# Altium schematic sheet rxcalibrate.SchDoc
size 762 x 762 mm
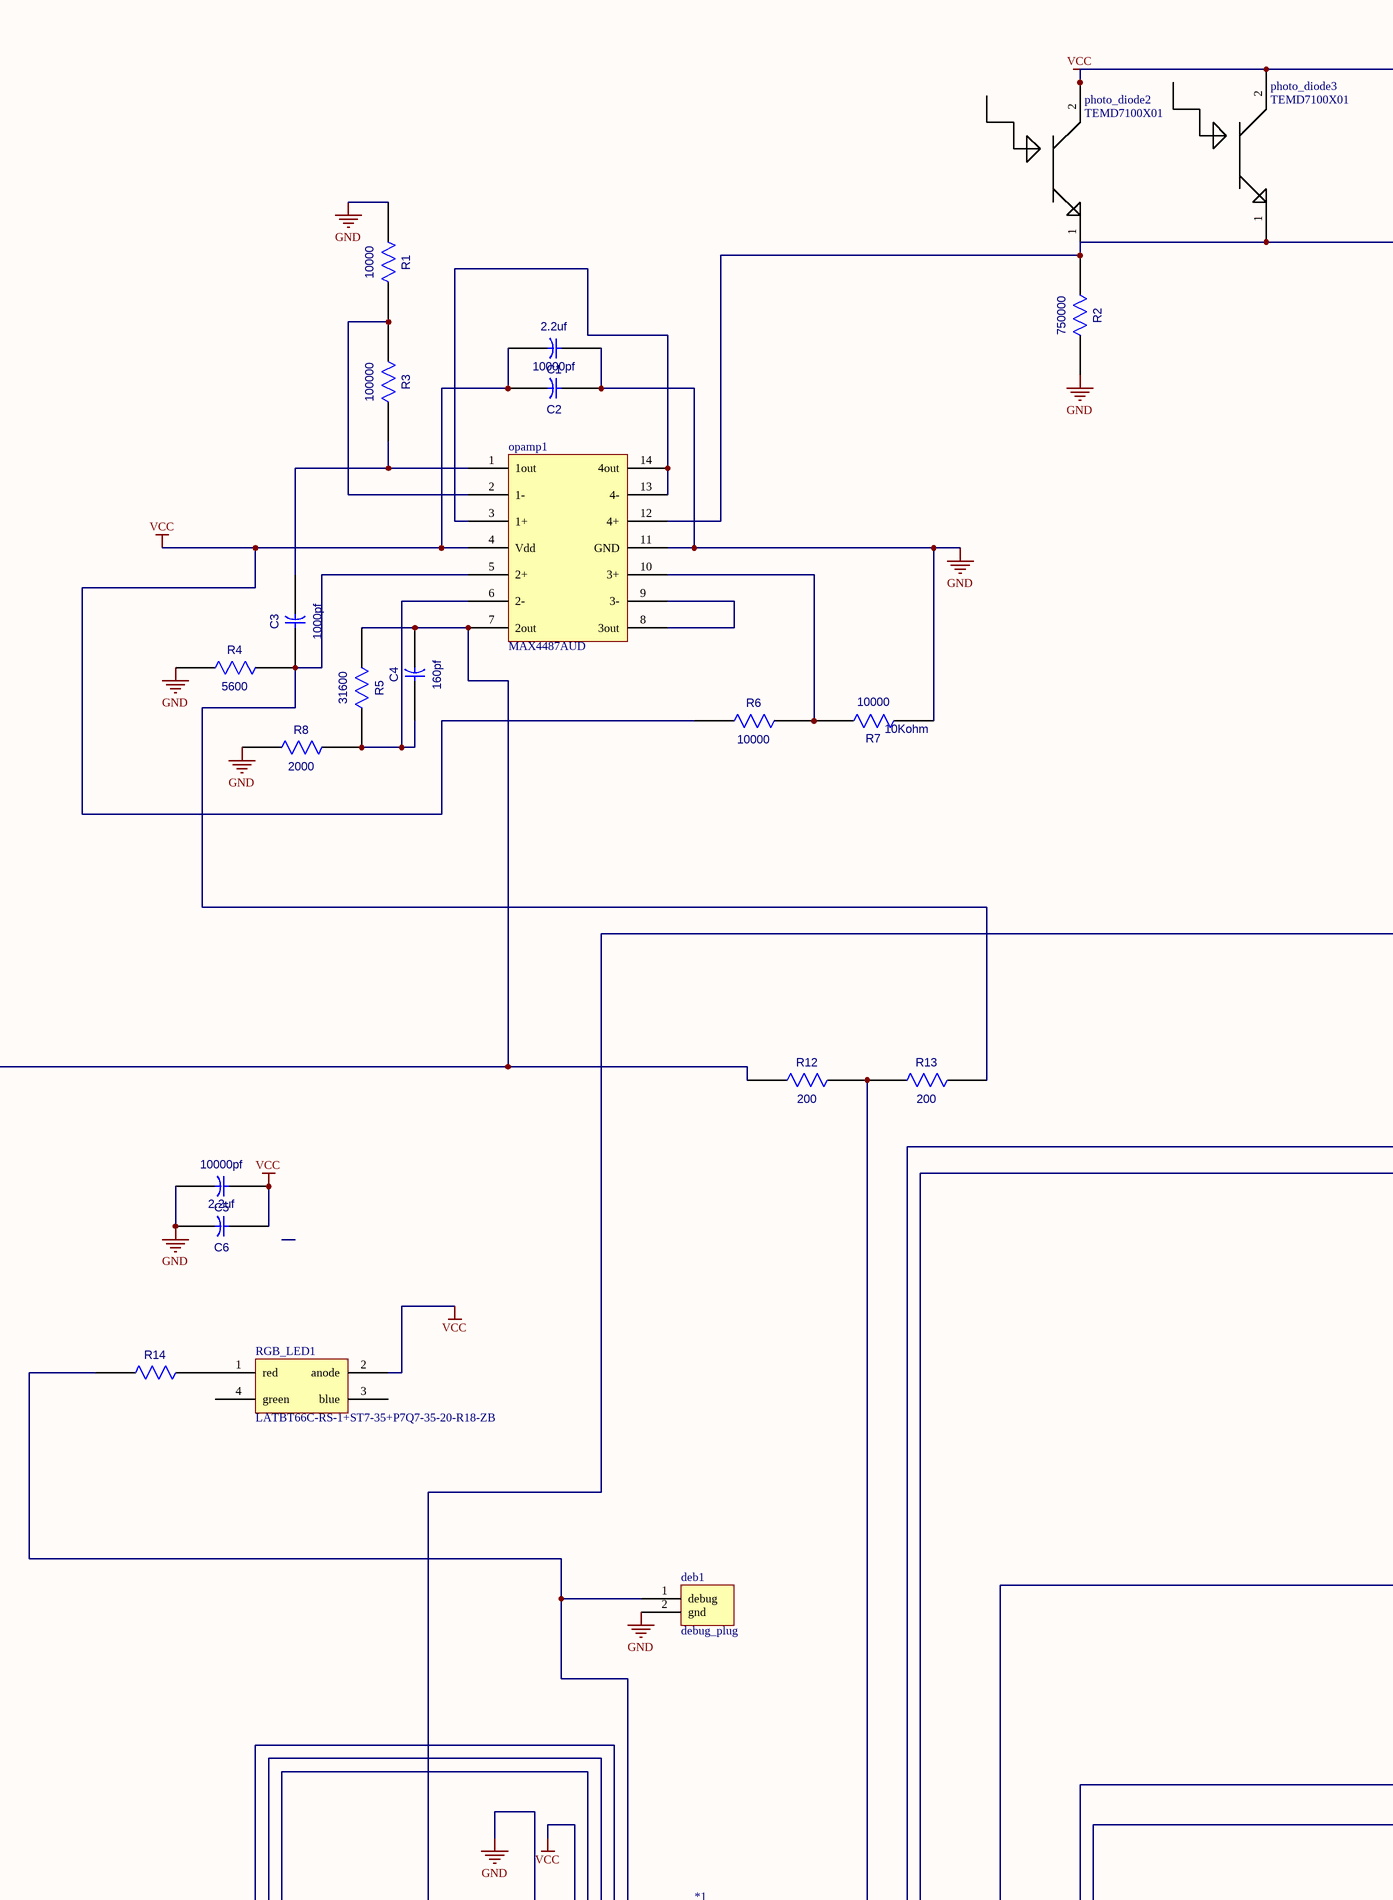
[diagram p0: rxcalibrate.SchDoc, top left]
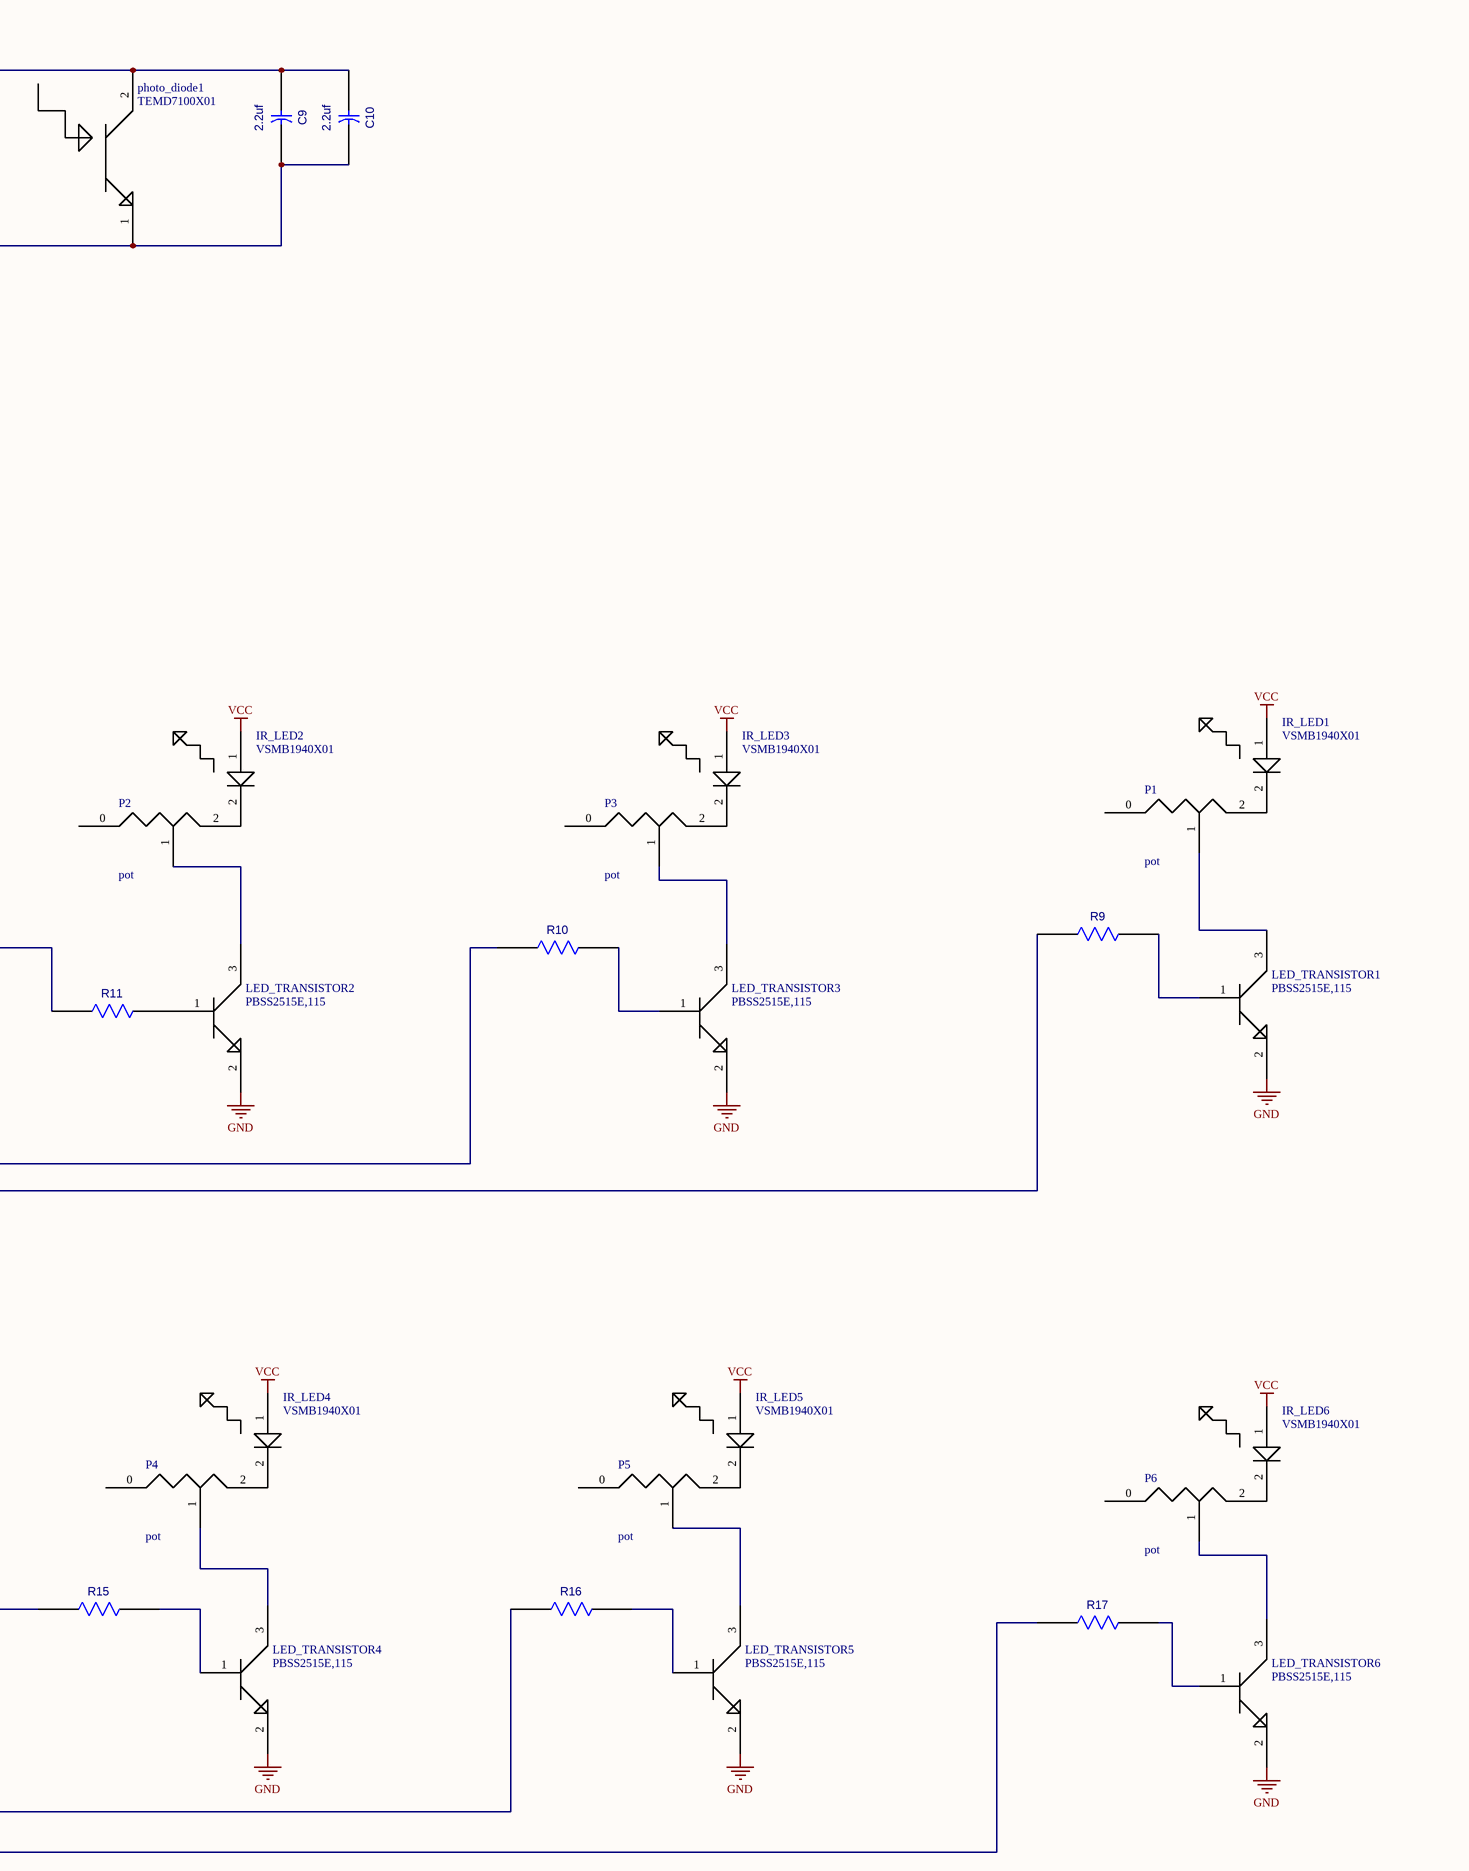
[diagram p1: rxcalibrate.SchDoc, top right]
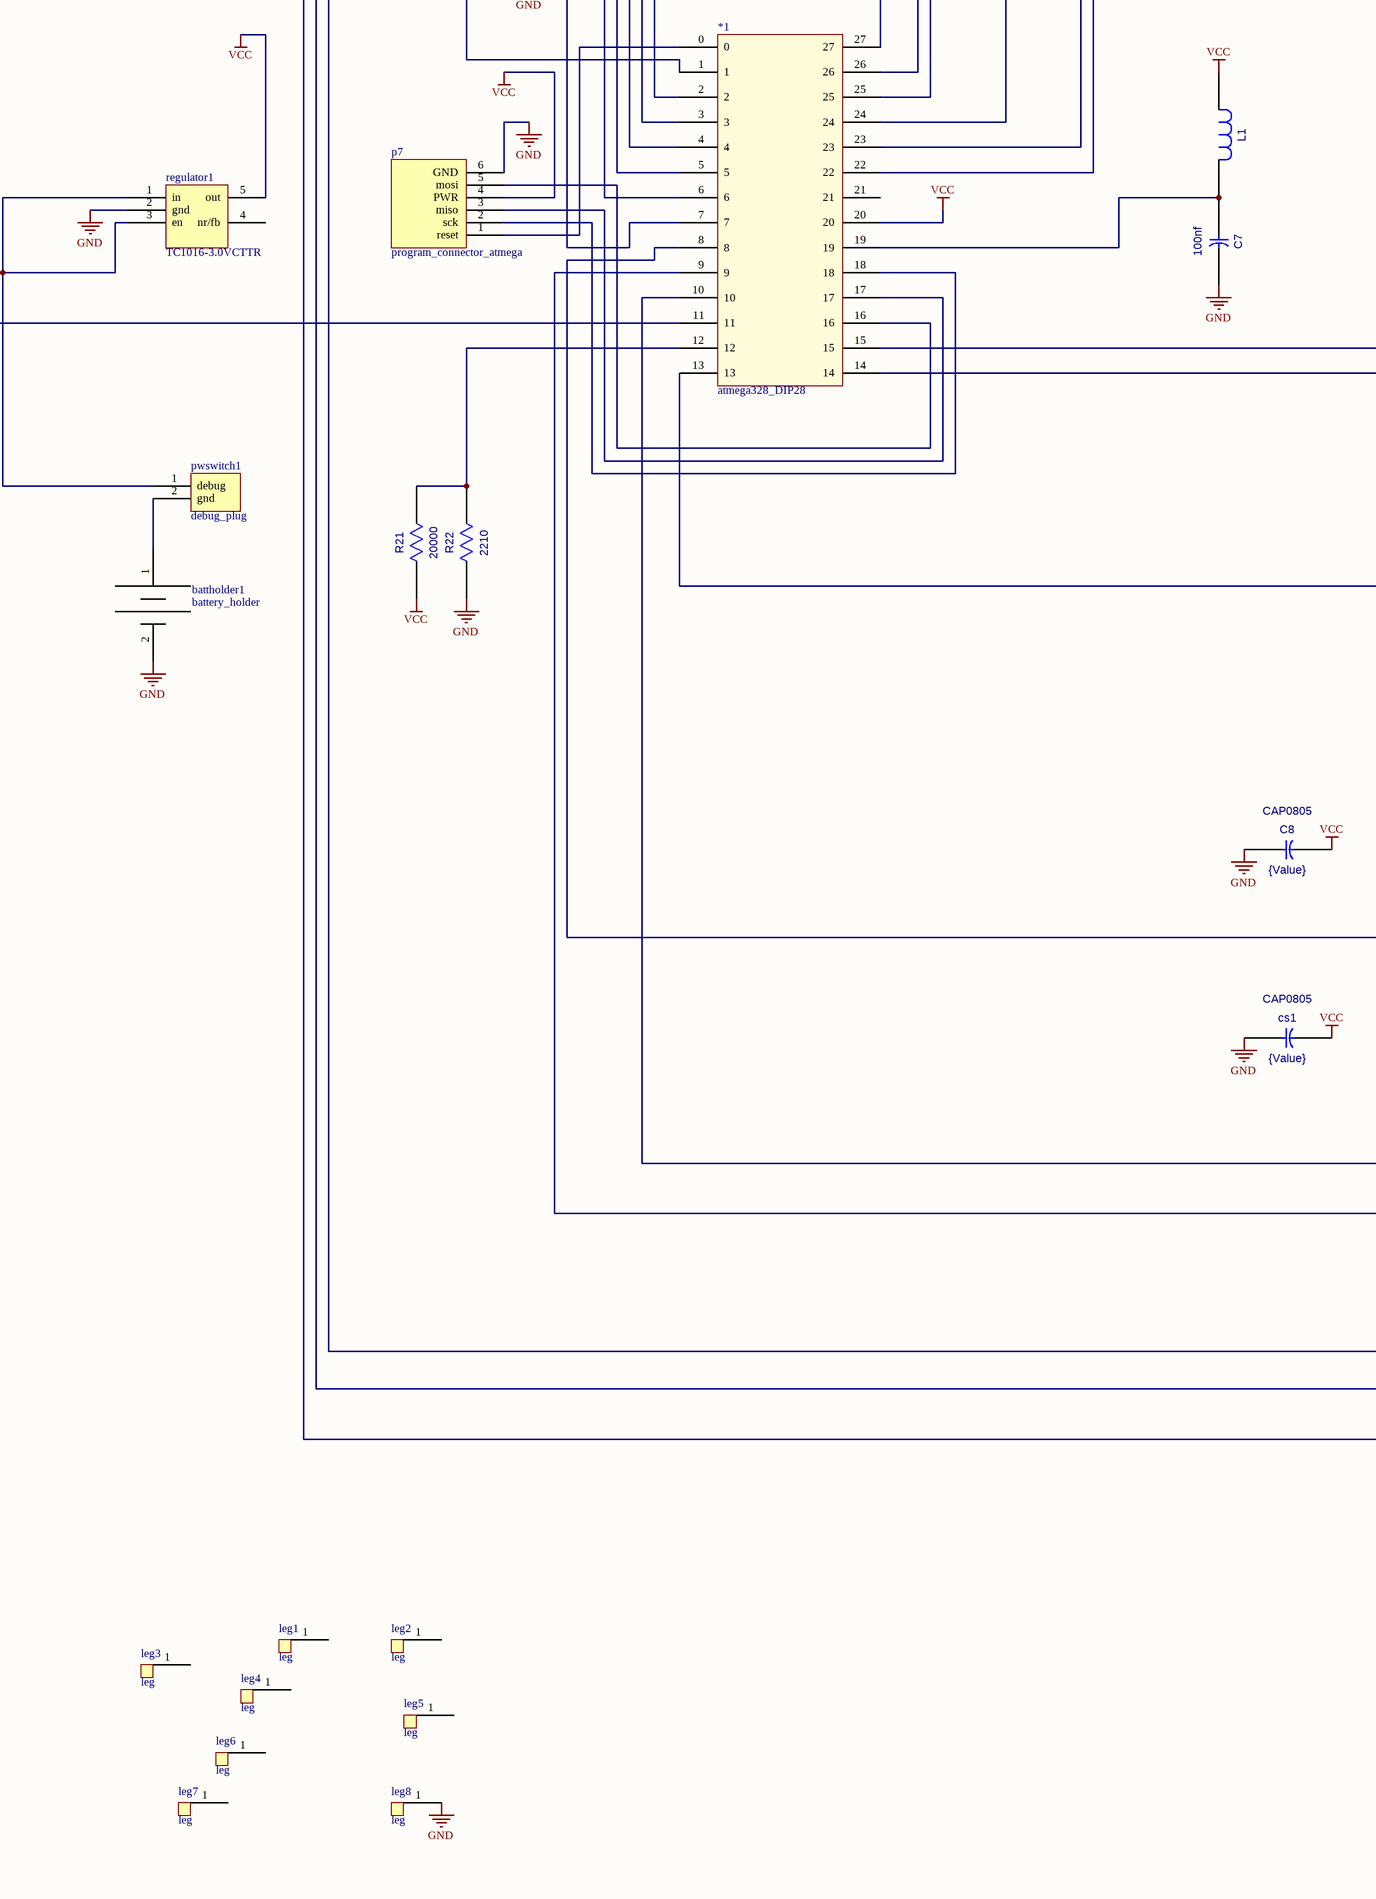
[diagram p2: rxcalibrate.SchDoc, bottom left]
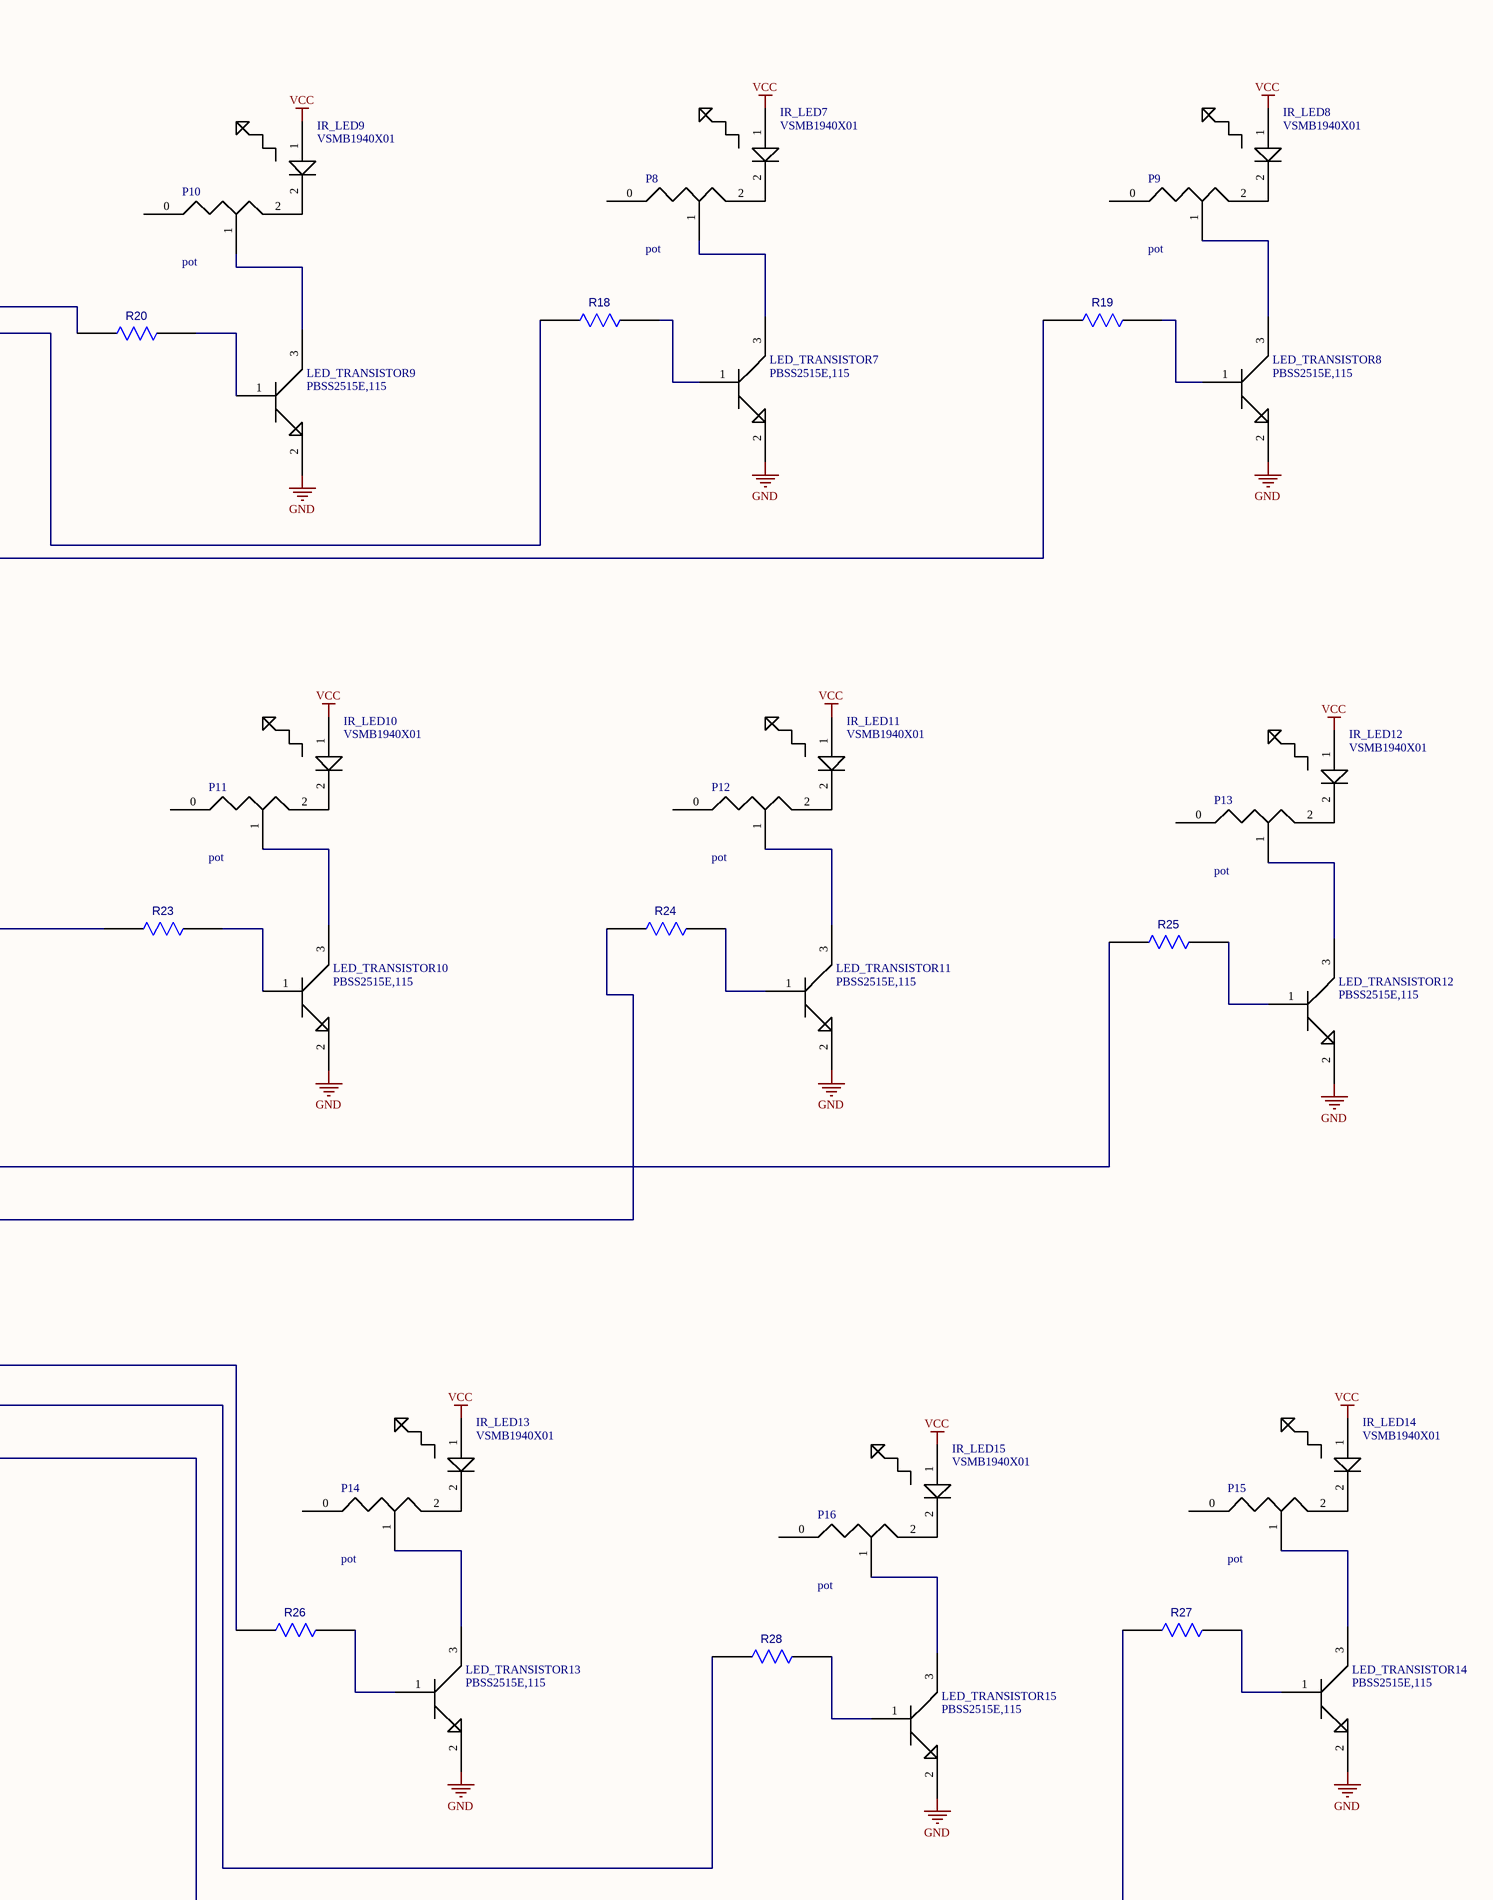
[diagram p3: rxcalibrate.SchDoc, bottom right]

## Parts
*1  atmega328_DIP28  [atmega328dip]
battholder1  battery_holder  [Battery_mount]
C1  2.2uf  [RC0603]
C2  10000pf  [RC0603]
C3  1000pf  [RC0603]
C4  160pf  [RC0603]
C5  10000pf  [RC0603]
C6  2.2uf  [RC0603]
C7  100nf  [RC0603]
C8  CAP0805  value {Value}  [RC0805_CAP0805(Primary)]
C9  2.2uf  [RC0603]
C10  2.2uf  [RC0603]
cs1  CAP0805  value {Value}  [RC0805_CAP0805(Primary)]
deb1  debug_plug  [debug_conn]
IR_LED1  VSMB1940X01  [0805]
IR_LED2  VSMB1940X01  [0805]
IR_LED3  VSMB1940X01  [0805]
IR_LED4  VSMB1940X01  [0805]
IR_LED5  VSMB1940X01  [0805]
IR_LED6  VSMB1940X01  [0805]
IR_LED7  VSMB1940X01  [0805]
IR_LED8  VSMB1940X01  [0805]
IR_LED9  VSMB1940X01  [0805]
IR_LED10  VSMB1940X01  [0805]
IR_LED11  VSMB1940X01  [0805]
IR_LED12  VSMB1940X01  [0805]
IR_LED13  VSMB1940X01  [0805]
IR_LED14  VSMB1940X01  [0805]
IR_LED15  VSMB1940X01  [0805]
L1  LQM18FN100M00D  [RC0603]  (value not drawn)
LED_TRANSISTOR1  PBSS2515E,115  [sot416]
LED_TRANSISTOR2  PBSS2515E,115  [sot416]
LED_TRANSISTOR3  PBSS2515E,115  [sot416]
LED_TRANSISTOR4  PBSS2515E,115  [sot416]
LED_TRANSISTOR5  PBSS2515E,115  [sot416]
LED_TRANSISTOR6  PBSS2515E,115  [sot416]
LED_TRANSISTOR7  PBSS2515E,115  [sot416]
LED_TRANSISTOR8  PBSS2515E,115  [sot416]
LED_TRANSISTOR9  PBSS2515E,115  [sot416]
LED_TRANSISTOR10  PBSS2515E,115  [sot416]
LED_TRANSISTOR11  PBSS2515E,115  [sot416]
LED_TRANSISTOR12  PBSS2515E,115  [sot416]
LED_TRANSISTOR13  PBSS2515E,115  [sot416]
LED_TRANSISTOR14  PBSS2515E,115  [sot416]
LED_TRANSISTOR15  PBSS2515E,115  [sot416]
leg1  leg  [leg]
leg2  leg  [leg]
leg3  leg  [leg]
leg4  leg  [leg]
leg5  leg  [leg]
leg6  leg  [leg]
leg7  leg  [leg]
leg8  leg  [leg]
opamp1  MAX4487AUD  [TSSOP14]
P1  pot  [POT_PV36W]
P2  pot  [POT_PV36W]
P3  pot  [POT_PV36W]
P4  pot  [POT_PV36W]
P5  pot  [POT_PV36W]
P6  pot  [POT_PV36W]
p7  program_connector_atmega  [Programming_connector]
P8  pot  [POT_PV36W]
P9  pot  [POT_PV36W]
P10  pot  [POT_PV36W]
P11  pot  [POT_PV36W]
P12  pot  [POT_PV36W]
P13  pot  [POT_PV36W]
P14  pot  [POT_PV36W]
P15  pot  [POT_PV36W]
P16  pot  [POT_PV36W]
photo_diode1  TEMD7100X01  [0805]
photo_diode2  TEMD7100X01  [0805]
photo_diode3  TEMD7100X01  [0805]
pwswitch1  debug_plug  [debug_conn]
R1  10 Kohm  [RC0603]  (value not drawn)
R2  750 K ohm  [RC0603]  (value not drawn)
R3  100Kohm  [RC0603]  (value not drawn)
R4  5600 ohm  [RC0603]  (value not drawn)
R5  31.6Kohm  [RC0603]  (value not drawn)
R6  10Kohm  [RC0603]  (value not drawn)
R7  10Kohm  [RC0603]
R8  2Kohm  [RC0603]  (value not drawn)
R9  RES0603  [RC0603]  (value not drawn)
R10  RES0603  [RC0603]  (value not drawn)
R11  RES0603  [RC0603]  (value not drawn)
R12  200 ohm  [RC0603]  (value not drawn)
R13  200 ohm  [RC0603]  (value not drawn)
R14  RES0603  [RC0603]  (value not drawn)
R15  RES0603  [RC0603]  (value not drawn)
R16  RES0603  [RC0603]  (value not drawn)
R17  RES0603  [RC0603]  (value not drawn)
R18  RES0603  [RC0603]  (value not drawn)
R19  RES0603  [RC0603]  (value not drawn)
R20  RES0603  [RC0603]  (value not drawn)
R21  20Kohm  [RC0603]  (value not drawn)
R22  2210 ohm  [RC0603]  (value not drawn)
R23  RES0603  [RC0603]  (value not drawn)
R24  RES0603  [RC0603]  (value not drawn)
R25  RES0603  [RC0603]  (value not drawn)
R26  RES0603  [RC0603]  (value not drawn)
R27  RES0603  [RC0603]  (value not drawn)
R28  RES0603  [RC0603]  (value not drawn)
regulator1  TC1016-3.0VCTTR  [SOT23-5]
RGB_LED1  LATBT66C-RS-1+ST7-35+P7Q7-35-20-R18-ZB  [rgb_led]

## Nets
GND: *1.7 battholder1.2 C1.2 C2.2 C5.1 C6.1 C7.1 C8.A cs1.A deb1.2(gnd) LED_TRANSISTOR1.2(out) LED_TRANSISTOR2.2(out) LED_TRANSISTOR3.2(out) LED_TRANSISTOR4.2(out) LED_TRANSISTOR5.2(out) LED_TRANSISTOR6.2(out) LED_TRANSISTOR7.2(out) LED_TRANSISTOR8.2(out) LED_TRANSISTOR9.2(out) LED_TRANSISTOR10.2(out) LED_TRANSISTOR11.2(out) LED_TRANSISTOR12.2(out) LED_TRANSISTOR13.2(out) LED_TRANSISTOR14.2(out) LED_TRANSISTOR15.2(out) leg8.1(out) opamp1.11(GND) p7.6(GND) R1.2(B) R2.1(A) R4.2(B) R7.2(B) R8.2(B) R22.2(B) regulator1.2(gnd)
VCC: *1.6 *1.20 C1.1 C2.1 C5.2 C6.2 C8.B C9.2 C10.2 cs1.B IR_LED1.1 IR_LED2.1 IR_LED3.1 IR_LED4.1 IR_LED5.1 IR_LED6.1 IR_LED7.1 IR_LED8.1 IR_LED9.1 IR_LED10.1 IR_LED11.1 IR_LED12.1 IR_LED13.1 IR_LED14.1 IR_LED15.1 L1.1(B) opamp1.4(Vdd) p7.4(PWR) photo_diode1.2 photo_diode2.2 photo_diode3.2 R6.2(B) R21.2(B) regulator1.5(out) RGB_LED1.2(anode)
Net*1_0: *1.0 p7.1(reset)
Net*1_1: *1.1 R11.2(B)
Net*1_2: *1.2 deb1.1(debug) R14.2(B)
Net*1_3: *1.3 R27.2(B)
Net*1_4: *1.4 R28.2(B)
Net*1_5: *1.5 R26.2(B)
Net*1_8: *1.8 R23.2(B)
Net*1_9: *1.9 R24.2(B)
Net*1_10: *1.10 R25.2(B)
Net*1_11: *1.11 C4.1 opamp1.7(2out) R5.2(B) R12.2(B)
Net*1_12: *1.12 R21.1(A) R22.1(A)
Net*1_13: *1.13 R19.2(B)
Net*1_14: *1.14 R18.2(B)
Net*1_15: *1.15 R20.2(B)
Net*1_16: *1.16 p7.5(mosi)
Net*1_17: *1.17 p7.3(miso)
Net*1_18: *1.18 p7.2(sck)
Net*1_19: *1.19 C7.2 L1.2(A)
Net*1_22: *1.22 R17.2(B)
Net*1_23: *1.23 R16.2(B)
Net*1_24: *1.24 R15.2(B)
Net*1_25: *1.25 R9.2(B)
Net*1_26: *1.26 R10.2(B)
Net*1_27: *1.27 R12.1(A) R13.2(B)
Netbattholder1_1: battholder1.1 pwswitch1.2(gnd)
NetC3_1: C3.1 opamp1.1(1out) R3.1(A)
NetC3_2: C3.2 opamp1.5(2+) R4.1(A) R13.1(A)
NetC4_2: C4.2 opamp1.6(2-) R5.1(A) R8.1(A)
NetC9_1: C9.1 C10.1 opamp1.12(4+) photo_diode1.1 photo_diode2.1 photo_diode3.1 R2.2(B)
NetIR_LED1_2: IR_LED1.2 P1.2
NetIR_LED2_2: IR_LED2.2 P2.2
NetIR_LED3_2: IR_LED3.2 P3.2
NetIR_LED4_2: IR_LED4.2 P4.2
NetIR_LED5_2: IR_LED5.2 P5.2
NetIR_LED6_2: IR_LED6.2 P6.2
NetIR_LED7_2: IR_LED7.2 P8.2
NetIR_LED8_2: IR_LED8.2 P9.2
NetIR_LED9_2: IR_LED9.2 P10.2
NetIR_LED10_2: IR_LED10.2 P11.2
NetIR_LED11_2: IR_LED11.2 P12.2
NetIR_LED12_2: IR_LED12.2 P13.2
NetIR_LED13_2: IR_LED13.2 P14.2
NetIR_LED14_2: IR_LED14.2 P15.2
NetIR_LED15_2: IR_LED15.2 P16.2
NetLED_TRANSISTOR1_1: LED_TRANSISTOR1.1(out) R9.1(A)
NetLED_TRANSISTOR1_3: LED_TRANSISTOR1.3 P1.1
NetLED_TRANSISTOR2_1: LED_TRANSISTOR2.1(out) R11.1(A)
NetLED_TRANSISTOR2_3: LED_TRANSISTOR2.3 P2.1
NetLED_TRANSISTOR3_1: LED_TRANSISTOR3.1(out) R10.1(A)
NetLED_TRANSISTOR3_3: LED_TRANSISTOR3.3 P3.1
NetLED_TRANSISTOR4_1: LED_TRANSISTOR4.1(out) R15.1(A)
NetLED_TRANSISTOR4_3: LED_TRANSISTOR4.3 P4.1
NetLED_TRANSISTOR5_1: LED_TRANSISTOR5.1(out) R16.1(A)
NetLED_TRANSISTOR5_3: LED_TRANSISTOR5.3 P5.1
NetLED_TRANSISTOR6_1: LED_TRANSISTOR6.1(out) R17.1(A)
NetLED_TRANSISTOR6_3: LED_TRANSISTOR6.3 P6.1
NetLED_TRANSISTOR7_1: LED_TRANSISTOR7.1(out) R18.1(A)
NetLED_TRANSISTOR7_3: LED_TRANSISTOR7.3 P8.1
NetLED_TRANSISTOR8_1: LED_TRANSISTOR8.1(out) R19.1(A)
NetLED_TRANSISTOR8_3: LED_TRANSISTOR8.3 P9.1
NetLED_TRANSISTOR9_1: LED_TRANSISTOR9.1(out) R20.1(A)
NetLED_TRANSISTOR9_3: LED_TRANSISTOR9.3 P10.1
NetLED_TRANSISTOR10_1: LED_TRANSISTOR10.1(out) R23.1(A)
NetLED_TRANSISTOR10_3: LED_TRANSISTOR10.3 P11.1
NetLED_TRANSISTOR11_1: LED_TRANSISTOR11.1(out) R24.1(A)
NetLED_TRANSISTOR11_3: LED_TRANSISTOR11.3 P12.1
NetLED_TRANSISTOR12_1: LED_TRANSISTOR12.1(out) R25.1(A)
NetLED_TRANSISTOR12_3: LED_TRANSISTOR12.3 P13.1
NetLED_TRANSISTOR13_1: LED_TRANSISTOR13.1(out) R26.1(A)
NetLED_TRANSISTOR13_3: LED_TRANSISTOR13.3 P14.1
NetLED_TRANSISTOR14_1: LED_TRANSISTOR14.1(out) R27.1(A)
NetLED_TRANSISTOR14_3: LED_TRANSISTOR14.3 P15.1
NetLED_TRANSISTOR15_1: LED_TRANSISTOR15.1(out) R28.1(A)
NetLED_TRANSISTOR15_3: LED_TRANSISTOR15.3 P16.1
Netopamp1_2: opamp1.2(1-) R1.1(A) R3.2(B)
Netopamp1_3: opamp1.3(1+) opamp1.13(4-) opamp1.14(4out)
Netopamp1_8: opamp1.8(3out) opamp1.9(3-)
Netopamp1_10: opamp1.10(3+) R6.1(A) R7.1(A)
Netpwswitch1_1: pwswitch1.1(debug) regulator1.1(in) regulator1.3(en)
NetR14_1: R14.1(A) RGB_LED1.1(red)

Not connected (* = marked no-connect by the designer): *1 21; leg1 1(out); leg2 1(out); leg3 1(out); leg4 1(out); leg5 1(out); leg6 1(out); leg7 1(out); P1 0; P2 0; P3 0; P4 0; P5 0; P6 0; P8 0; P9 0; P10 0; P11 0; P12 0; P13 0; P14 0; P15 0; P16 0; regulator1 4(nr/fb); RGB_LED1 3(blue) 4(green)

## Notes on the sheet
- (in symbol RES0603) 100000; 10000; 31600; 2000; 5600; 20000; 2210; 200; 750000

## Library data of the parts
C1-C7 C9 C10 = CAP0603
IR_LED1-IR_LED15 = IRtx
L1 = IND0603: Value: {Value}
LED_TRANSISTOR1-LED_TRANSISTOR15 = transistor_led
opamp1 = opamp
photo_diode1-photo_diode3 = IRrx
R1 R6 R7 = RES0603: RES0603 10Kohm
R2 = RES0603: RES0603 750000 ohm
R3 = RES0603: RES0603 100Kohm
R4 = RES0603: RES0603 5600 ohm
R5 = RES0603: RES0603 31.6Kohm
R8 = RES0603: RES0603 2Kohm
R9-R11 R14-R20 R23-R28 = RES0603: Value: {Value}
R12 R13 = RES0603: RES0603 200 ohm
R21 = RES0603: RES0603 20Kohm
R22 = RES0603: RES0603 2210 ohm
regulator1 = regulator_w_switch
RGB_LED1 = rgb_led